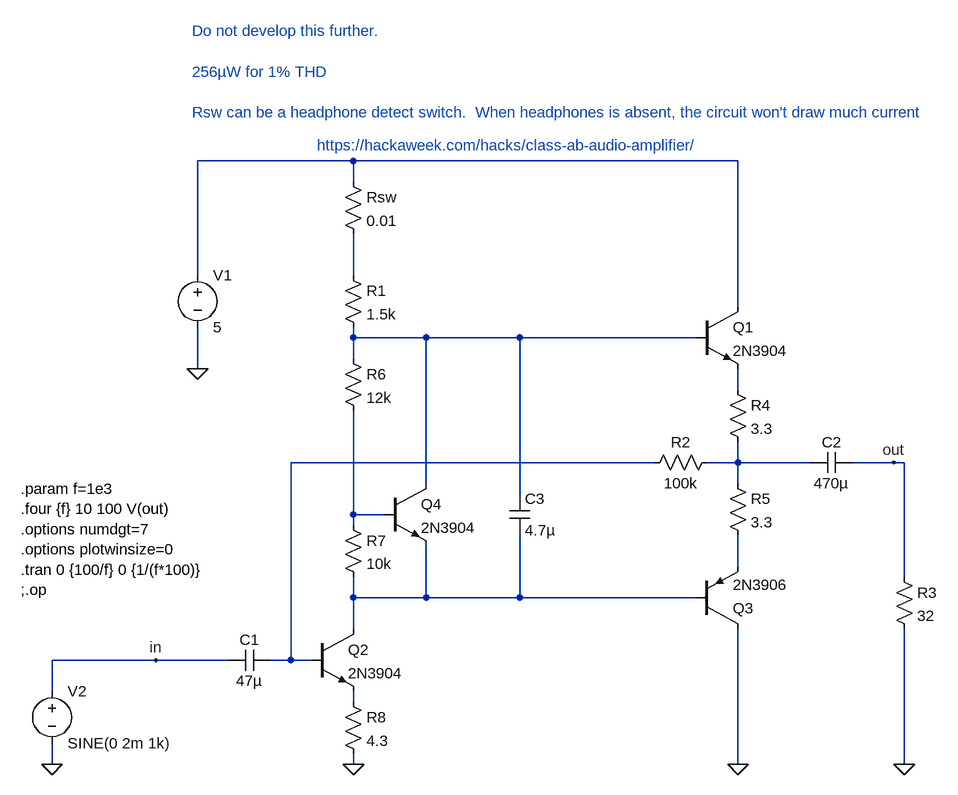
[diagram p0: schematic Hackaweek.asc]
Hackaweek.asc, the LTspice schematic file:
Version 4
SHEET 1 1932 836
WIRE 32 -256 -208 -256
WIRE 624 -256 32 -256
WIRE 32 -224 32 -256
WIRE -208 -80 -208 -256
WIRE 32 -80 32 -144
WIRE 624 -32 624 -256
WIRE 32 16 32 0
WIRE 144 16 32 16
WIRE 288 16 144 16
WIRE 560 16 288 16
WIRE 32 48 32 16
WIRE -208 64 -208 0
WIRE 624 96 624 64
WIRE 496 208 -64 208
WIRE 624 208 624 176
WIRE 624 208 576 208
WIRE 736 208 624 208
WIRE 864 208 800 208
WIRE 880 208 864 208
WIRE 144 240 144 16
WIRE 624 240 624 208
WIRE 288 256 288 16
WIRE 32 288 32 128
WIRE 80 288 32 288
WIRE 32 304 32 288
WIRE 624 368 624 320
WIRE 880 384 880 208
WIRE 32 416 32 384
WIRE 144 416 144 336
WIRE 144 416 32 416
WIRE 288 416 288 320
WIRE 288 416 144 416
WIRE 560 416 288 416
WIRE 32 464 32 416
WIRE -272 512 -432 512
WIRE -160 512 -272 512
WIRE -64 512 -64 208
WIRE -64 512 -96 512
WIRE -32 512 -64 512
WIRE -432 560 -432 512
WIRE 32 576 32 560
WIRE -432 672 -432 640
WIRE 32 672 32 656
WIRE 624 672 624 464
WIRE 880 672 880 464
FLAG -432 672 0
FLAG 32 672 0
FLAG 624 672 0
FLAG -208 64 0
FLAG 880 672 0
FLAG 864 208 out
FLAG -272 512 in
SYMBOL npn 560 -32 R0
SYMATTR InstName Q1
SYMATTR Value 2N3904
SYMBOL npn -32 464 R0
SYMATTR InstName Q2
SYMATTR Value 2N3904
SYMBOL pnp 560 464 M180
SYMATTR InstName Q3
SYMATTR Value 2N3906
SYMBOL res 16 -96 R0
SYMATTR InstName R1
SYMATTR Value 1.5k
SYMBOL res 592 192 R90
WINDOW 0 0 56 VBottom 2
WINDOW 3 32 56 VTop 2
SYMATTR InstName R2
SYMATTR Value 100k
SYMBOL voltage -208 -96 R0
SYMATTR InstName V1
SYMATTR Value 5
SYMBOL voltage -432 544 R0
WINDOW 123 0 0 Left 0
WINDOW 39 0 0 Left 0
SYMATTR InstName V2
SYMATTR Value SINE(0 2m 1k)
SYMBOL cap -96 496 R90
WINDOW 0 0 32 VBottom 2
WINDOW 3 32 32 VTop 2
SYMATTR InstName C1
SYMATTR Value 47µ
SYMBOL cap 800 192 R90
WINDOW 0 0 32 VBottom 2
WINDOW 3 32 32 VTop 2
SYMATTR InstName C2
SYMATTR Value 470µ
SYMBOL res 864 368 R0
SYMATTR InstName R3
SYMATTR Value 32
SYMBOL res 608 80 R0
SYMATTR InstName R4
SYMATTR Value 3.3
SYMBOL res 608 224 R0
SYMATTR InstName R5
SYMATTR Value 3.3
SYMBOL res 16 32 R0
SYMATTR InstName R6
SYMATTR Value 12k
SYMBOL res 16 288 R0
SYMATTR InstName R7
SYMATTR Value 10k
SYMBOL npn 80 240 R0
SYMATTR InstName Q4
SYMATTR Value 2N3904
SYMBOL res 16 560 R0
SYMATTR InstName R8
SYMATTR Value 4.3
SYMBOL res 16 -240 R0
SYMATTR InstName Rsw
SYMATTR Value 0.01
SYMBOL cap 272 256 R0
SYMATTR InstName C3
SYMATTR Value 4.7µ
TEXT -24 -280 Left 2 ;https://hackaweek.com/hacks/class-ab-audio-amplifier/
TEXT -480 248 Left 2 !.param f=1e3\n.four {f} 10 100 V(out)\n.options numdgt=7\n.options plotwinsize=0\n.tran 0 {100/f} 0 {1/(f*100)}\n;.op
TEXT -216 -456 Left 2 ;Do not develop this further.\n \n256µW for 1% THD\n \nRsw can be a headphone detect switch.  When headphones is absent, the circuit won't draw much current

The netlist it stands for:
* Hackaweek.asc
Q1 N001 N003 N004 0 2N3904
Q2 N009 N005 N010 0 2N3904
Q3 0 N009 N008 0 2N3906
R1 N002 N003 1.5k
R2 N006 N005 100k
V1 N001 0 5
V2 in 0 SINE(0 2m 1k)
C1 N005 in 47µ
C2 out N006 470µ
R3 out 0 32
R4 N004 N006 3.3
R5 N006 N008 3.3
R6 N003 N007 12k
R7 N007 N009 10k
Q4 N003 N007 N009 0 2N3904
R8 N010 0 4.3
Rsw N001 N002 0.01
C3 N003 N009 4.7µ
.model NPN NPN
.model PNP PNP
.lib standard.bjt
* https://hackaweek.com/hacks/class-ab-audio-amplifier/
.param f=1e3
.four {f} 10 100 V(out)
.options numdgt=7
.options plotwinsize=0
.tran 0 {100/f} 0 {1/(f*100)}
;.op
* Do not develop this further.
* 256µW for 1% THD
* Rsw can be a headphone detect switch.  When headphones is absent, the circuit won't draw much current
.backanno
.end